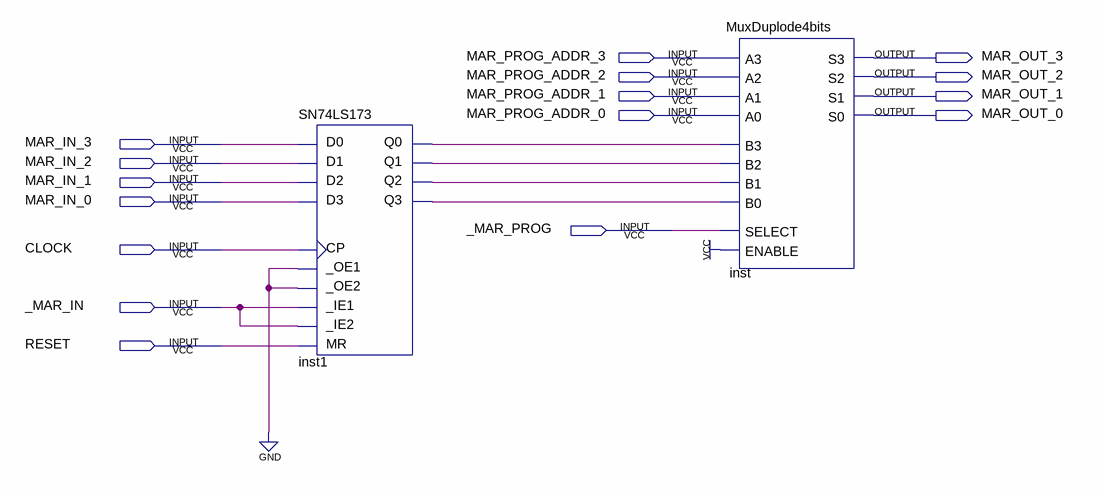
[diagram p0: schematic sheet]
// Quartus schematic MAR.bdf as structural Verilog: 2 symbols, 16 pins
module MAR (
  input  MAR_PROG_ADDR_3,
  input  MAR_PROG_ADDR_2,
  input  MAR_PROG_ADDR_1,
  input  MAR_PROG_ADDR_0,
  input  MAR_IN_3,
  input  MAR_IN_2,
  input  MAR_IN_1,
  input  MAR_IN_0,
  input  _MAR_PROG,
  input  CLOCK,
  input  _MAR_IN,
  input  RESET,
  output MAR_OUT_3,
  output MAR_OUT_2,
  output MAR_OUT_1,
  output MAR_OUT_0
);

  wire inst1_q0, inst1_q1, inst1_q2, inst1_q3;

  SN74LS173 inst1 (
    .D0(MAR_IN_3), .D1(MAR_IN_2), .D2(MAR_IN_1), .D3(MAR_IN_0), ._IE1(_MAR_IN), ._IE2(_MAR_IN), .CP(CLOCK),
    .MR(RESET), ._OE1(1'b0), ._OE2(1'b0), .Q0(inst1_q0), .Q1(inst1_q1), .Q2(inst1_q2), .Q3(inst1_q3));
  MuxDuplode4bits inst (
    .SELECT(_MAR_PROG), .ENABLE(1'b1), .A3(MAR_PROG_ADDR_3), .B3(inst1_q0), .A2(MAR_PROG_ADDR_2),
    .B2(inst1_q1), .A1(MAR_PROG_ADDR_1), .B1(inst1_q2), .A0(MAR_PROG_ADDR_0), .B0(inst1_q3), .S3(MAR_OUT_3),
    .S2(MAR_OUT_2), .S1(MAR_OUT_1), .S0(MAR_OUT_0));
endmodule
